# EAGLE design bene2stmbl-smd (EAGLE 7.2.0)
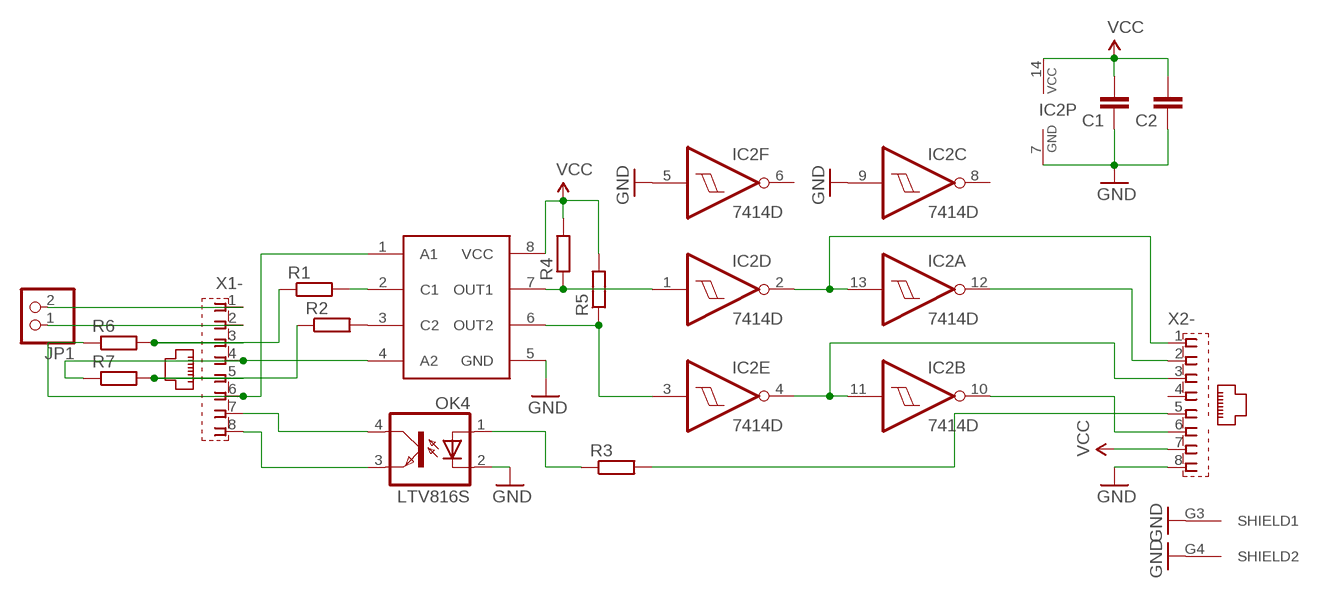
[diagram p0: schematic, sheet 1]

## Parts
C1  C-EUC0603  [C0603]
C2  C-EUC0603  [C0603]
IC2  7414D  [SO14]
JP1  PINHD-1X2  [1X02]
OK4  LTV816S  [SMD4]
R1  R-EU_R0603  [R0603]
R2  R-EU_R0603  [R0603]
R3  R-EU_R0603  [R0603]
R4  R-EU_R0603  [R0603]
R5  R-EU_R0603  [R0603]
R6  R-EU_R0603  [R0603]
R7  R-EU_R0603  [R0603]
U$1  HCPL-053L-SMD  [SO08]
X1  RJ45  [RJ45]
X2  RJ45  [RJ45]

## Nets
GND: C1.1 C2.1 IC2.5(F:I) IC2.7(P:GND) IC2.9(C:I) OK4.2(C) U$1.5(GND) X2.8 X2.G3(SHIELD1) X2.G4(SHIELD2)
N$1: OK4.3(EMIT) X1.8
N$2: OK4.4(COL) X1.7
N$3: IC2.2(D:O) IC2.13(A:I) X2.1
N$4: R6.1 U$1.1(A1) X1.6
N$5: IC2.4(E:O) IC2.11(B:I) X2.3
N$6: R2.1 R7.2 X1.5
N$7: R1.2 U$1.2(C1)
N$8: R2.2 U$1.3(C2)
N$9: JP1.1 X1.2
N$10: JP1.2 X1.1
N$12: IC2.1(D:I) R4.1 U$1.7(OUT1)
N$13: IC2.12(A:O) X2.2
N$14: R1.1 R6.2 X1.3
N$15: IC2.10(B:O) X2.6
N$16: OK4.1(A) R3.1
N$17: R7.1 U$1.4(A2) X1.4
N$18: R3.2 X2.5
N$20: IC2.3(E:I) R5.1 U$1.6(OUT2)
VCC: C1.2 C2.2 IC2.14(P:VCC) R4.2 R5.2 U$1.8(VCC) X2.7
Unconnected: IC2.6(F:O) IC2.8(C:O) X1.G3(SHIELD1) X1.G4(SHIELD2) X2.4

## Library data of the parts
C1 C2 = resistor:C-EU: CAPACITOR, European symbol
IC2 = 74xx-eu:74*14: Hex schmitt trigger INVERTER
JP1 = pinhead:PINHD-1X2: PIN HEADER
OK4 = optocoupler:LTV816: OPTO COUPLER Source: LITEON, LTV816.pdf; OC_FARNELL: unknown; OC_NEWARK: unknown
R1-R7 = resistor:R-EU_: RESISTOR, European symbol
U$1 = reroolib:HCPL-053L-SMD
X1 X2 = reroolib:RJ45: AMP connector

## Board
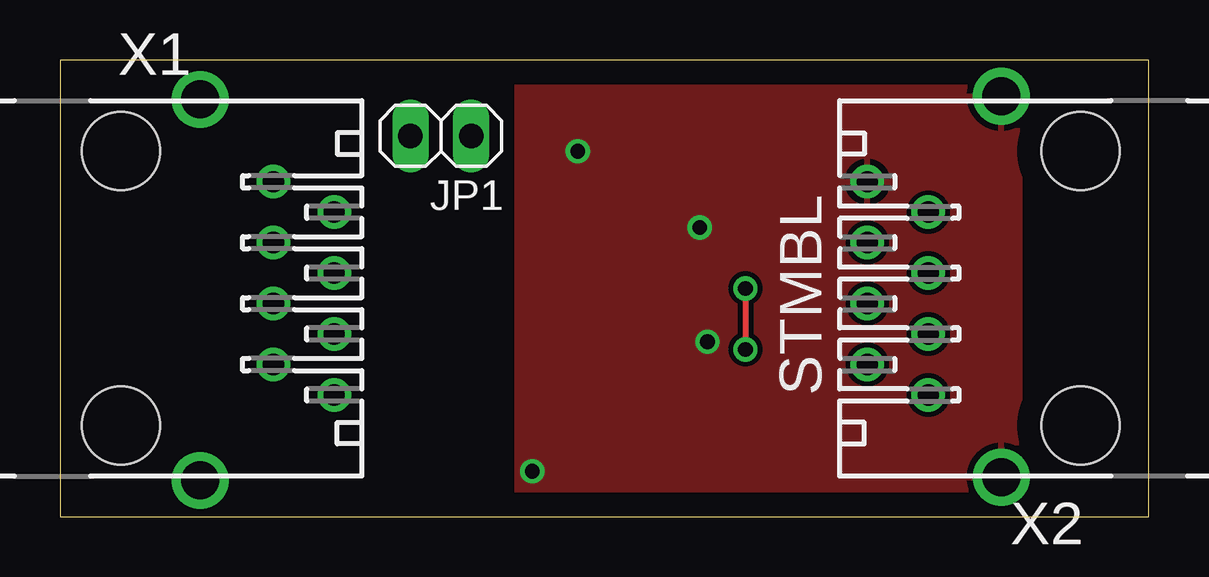
[diagram p1: board, top side]
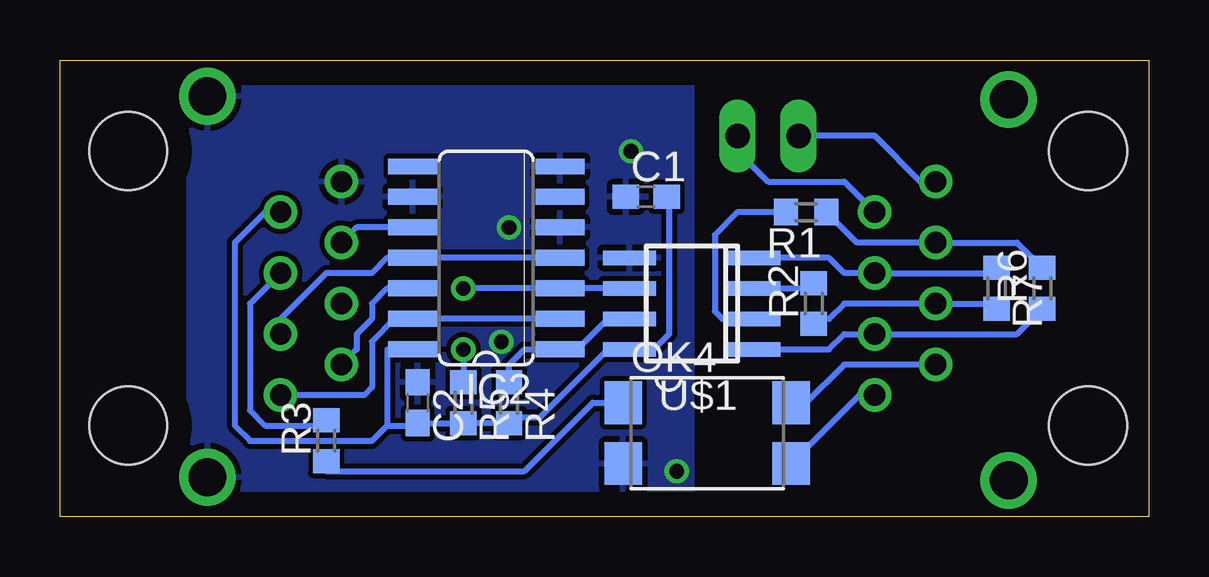
[diagram p2: board, bottom side, seen from below]

Size 45.39 x 19.04 mm. Coordinates in mm from the lower left corner, seen from the top.
Outline: 0,0 45.39,0 45.39,19.04 0,19.04 0,0
Copper layers (1*16): Top 0.035mm / dielectric 1.5mm / Bottom 0.035mm
Design rules "default": minimum track width 10mil, minimum drill 24mil, track to track 8mil, track to pad 8mil, pad to pad 8mil, via to via 8mil, smd to smd 8mil, copper to edge 40mil, drill to drill 8mil, minimum pad ring 10mil, minimum via ring 8mil, stop-mask expansion 4mil, vias tented up to drill 0mil, thermal gap 10mil

### Footprints (pad centres in the part's own frame; a part is rotated, then mirrored left to right if it is on the bottom)
C0603 = smd 1.1 x 1: 1 -0.85,0; 2 0.85,0
SO14 = smd 0.66 x 2.032: 1 -3.81,-3.073; 2 -2.54,-3.073; 3 -1.27,-3.073; 4 0,-3.073; 5 1.27,-3.073; 6 2.54,-3.073; 7 3.81,-3.073; 8 3.81,3.073; 9 2.54,3.073; 10 1.27,3.073; 11 0,3.073; 12 -1.27,3.073; 13 -2.54,3.073; 14 -3.81,3.073
1X02 = drill 1.016 long: 1 -1.27,0; 2 1.27,0
SMD4 = smd 1.78 x 1.55: 1 -1.27,-3.5; 2 1.27,-3.5; 3 1.27,3.5; 4 -1.27,3.5
R0603 = smd 1 x 1.1: 1 -0.85,0; 2 0.85,0
SO08 = smd 0.6 x 2.2: 1 -1.905,-2.6; 2 -0.635,-2.6; 3 0.635,-2.6; 4 1.905,-2.6; 5 1.905,2.6; 6 0.635,2.6; 7 -0.635,2.6; 8 -1.905,2.6
RJ45 = drill 0.889: 1 -4.445,6.35; 2 -3.175,8.89; 3 -1.905,6.35; 4 -0.635,8.89; 5 0.635,6.35; 6 1.905,8.89; 7 3.175,6.35; 8 4.445,8.89 | drill 1.575 pad 2.184: G3 -7.874,3.302; G4 8.001,3.302 | hole 3.251: -5.715,0; 5.715,0

### Placement (x,y rotation side)
C1  100n  [C0603]  20.95,13.34 0 bottom
C2  100n  [C0603]  30.48,4.76 270 bottom
IC2  27.62,10.79 90 bottom
JP1  15.88,15.88 180 top
OK4  18.41,3.49 270 bottom
R1  330  [R0603]  14.29,12.7 180 bottom
R2  330  [R0603]  13.97,8.89 90 bottom
R3  34.29,3.17 90 bottom
R4  3k9  [R0603]  26.67,4.76 270 bottom
R5  3k9  [R0603]  28.57,4.76 270 bottom
R6  4.45,9.53 90 bottom
R7  6.35,9.53 270 bottom
U$1  19.05,8.89 90 bottom
X1  2.54,9.53 270 top
X2  42.55,9.53 90 top

### Tracks (layer width: path | path; a pad name or v marks a point on that pad's centre or on a via)
GND  (via drill 0.61)
  other vias: 26.67,12.06 26.99,7.3 19.68,1.91 21.59,15.24
  pour Bottom: 19.05,0 19.05,19.05 40.01,19.05 40.01,0
  pour Top: 19.05,19.05 19.05,0 40.01,0 40.01,19.05
N$1
  Bottom 0.254: OK4.3 14.61,2.54 12.06,5.08 X1.8
N$2
  Bottom 0.254: X1.7 12.7,6.35 14.29,4.76 OK4.4
N$3
  Bottom 0.254: IC2.2 IC2.13 31.43,8.26 32.38,7.3 32.38,5.4 32.7,5.08 X2.1
N$4
  Bottom 0.254: R6.1 5.5,7.62 X1.6 12.7,7.62 13.34,6.99 U$1.1
N$5
  Bottom 0.254: IC2.4 IC2.11 31.75,10.79 32.38,10.16 34.29,10.16 36.2,8.26 X2.3
N$6
  Bottom 0.254: R7.2 6.57,8.89 X1.5 12.7,8.89 13.34,8.26 13.76,8.26 R2.1
N$7
  Bottom 0.254: R1.2 17.14,12.7 18.1,11.75 18.1,8.57 17.78,8.26 U$1.2
N$8
  Bottom 0.254: U$1.3 14.19,9.53 R2.2
N$9
  Bottom 0.254: JP1.1 17.14,15.24 15.88,13.97 12.7,13.97 X1.2
N$10
  Bottom 0.254: X1.1 9.53,13.97 11.43,15.88 JP1.2
N$12
  Bottom 0.254: U$1.7 22.54,8.26 23.81,6.99 IC2.1 26.04,6.99 26.67,6.35 R4.1
N$13
  Bottom 0.254: IC2.12 31.75,9.53 32.38,8.89 32.38,8.26 33.02,7.62 33.02,6.99 X2.2
N$14
  Bottom 0.254: R6.2 5.5,11.43 X1.3 12.17,11.43 R1.1
N$15
  Bottom 0.254: IC2.10 33.02,12.06 X2.6
N$16
  Bottom 0.254: R3.1 34.29,1.91 26.04,1.91 23.18,4.76 OK4.1
N$17
  Bottom 0.254: R7.1 6.57,10.16 X1.4 12.7,10.16 13.34,10.79 U$1.4
N$18
  Bottom 0.254: X2.5 37.47,8.89 37.47,4.45 36.83,3.81 34.51,3.81 R3.2
N$20  (via drill 0.61)
  Top 0.254: v28.57,9.53 v28.57,6.99
  Bottom 0.254: U$1.6 IC2.3 v28.57,9.53 | v28.57,6.99 R5.1
VCC
  Bottom 0.254: X2.7 36.83,12.7 38.1,11.43 38.1,3.81 37.47,3.17 32.38,3.17 31.75,3.81 | R5.2 R4.2 26.45,4.13 25.4,4.13 22.54,6.99 U$1.8 20.64,6.99 20,7.62 20,13.34 C1.2 | 28.68,3.81 R5.2 | IC2.14 30.48,6.77 31.53,6.77 31.75,6.99 31.75,3.81 | 31.75,3.81 30.58,3.81 C2.2 R5.2

### Text on the board
tPlace: STMBL